# EAGLE design PWM Module (EAGLE 9.2.2)
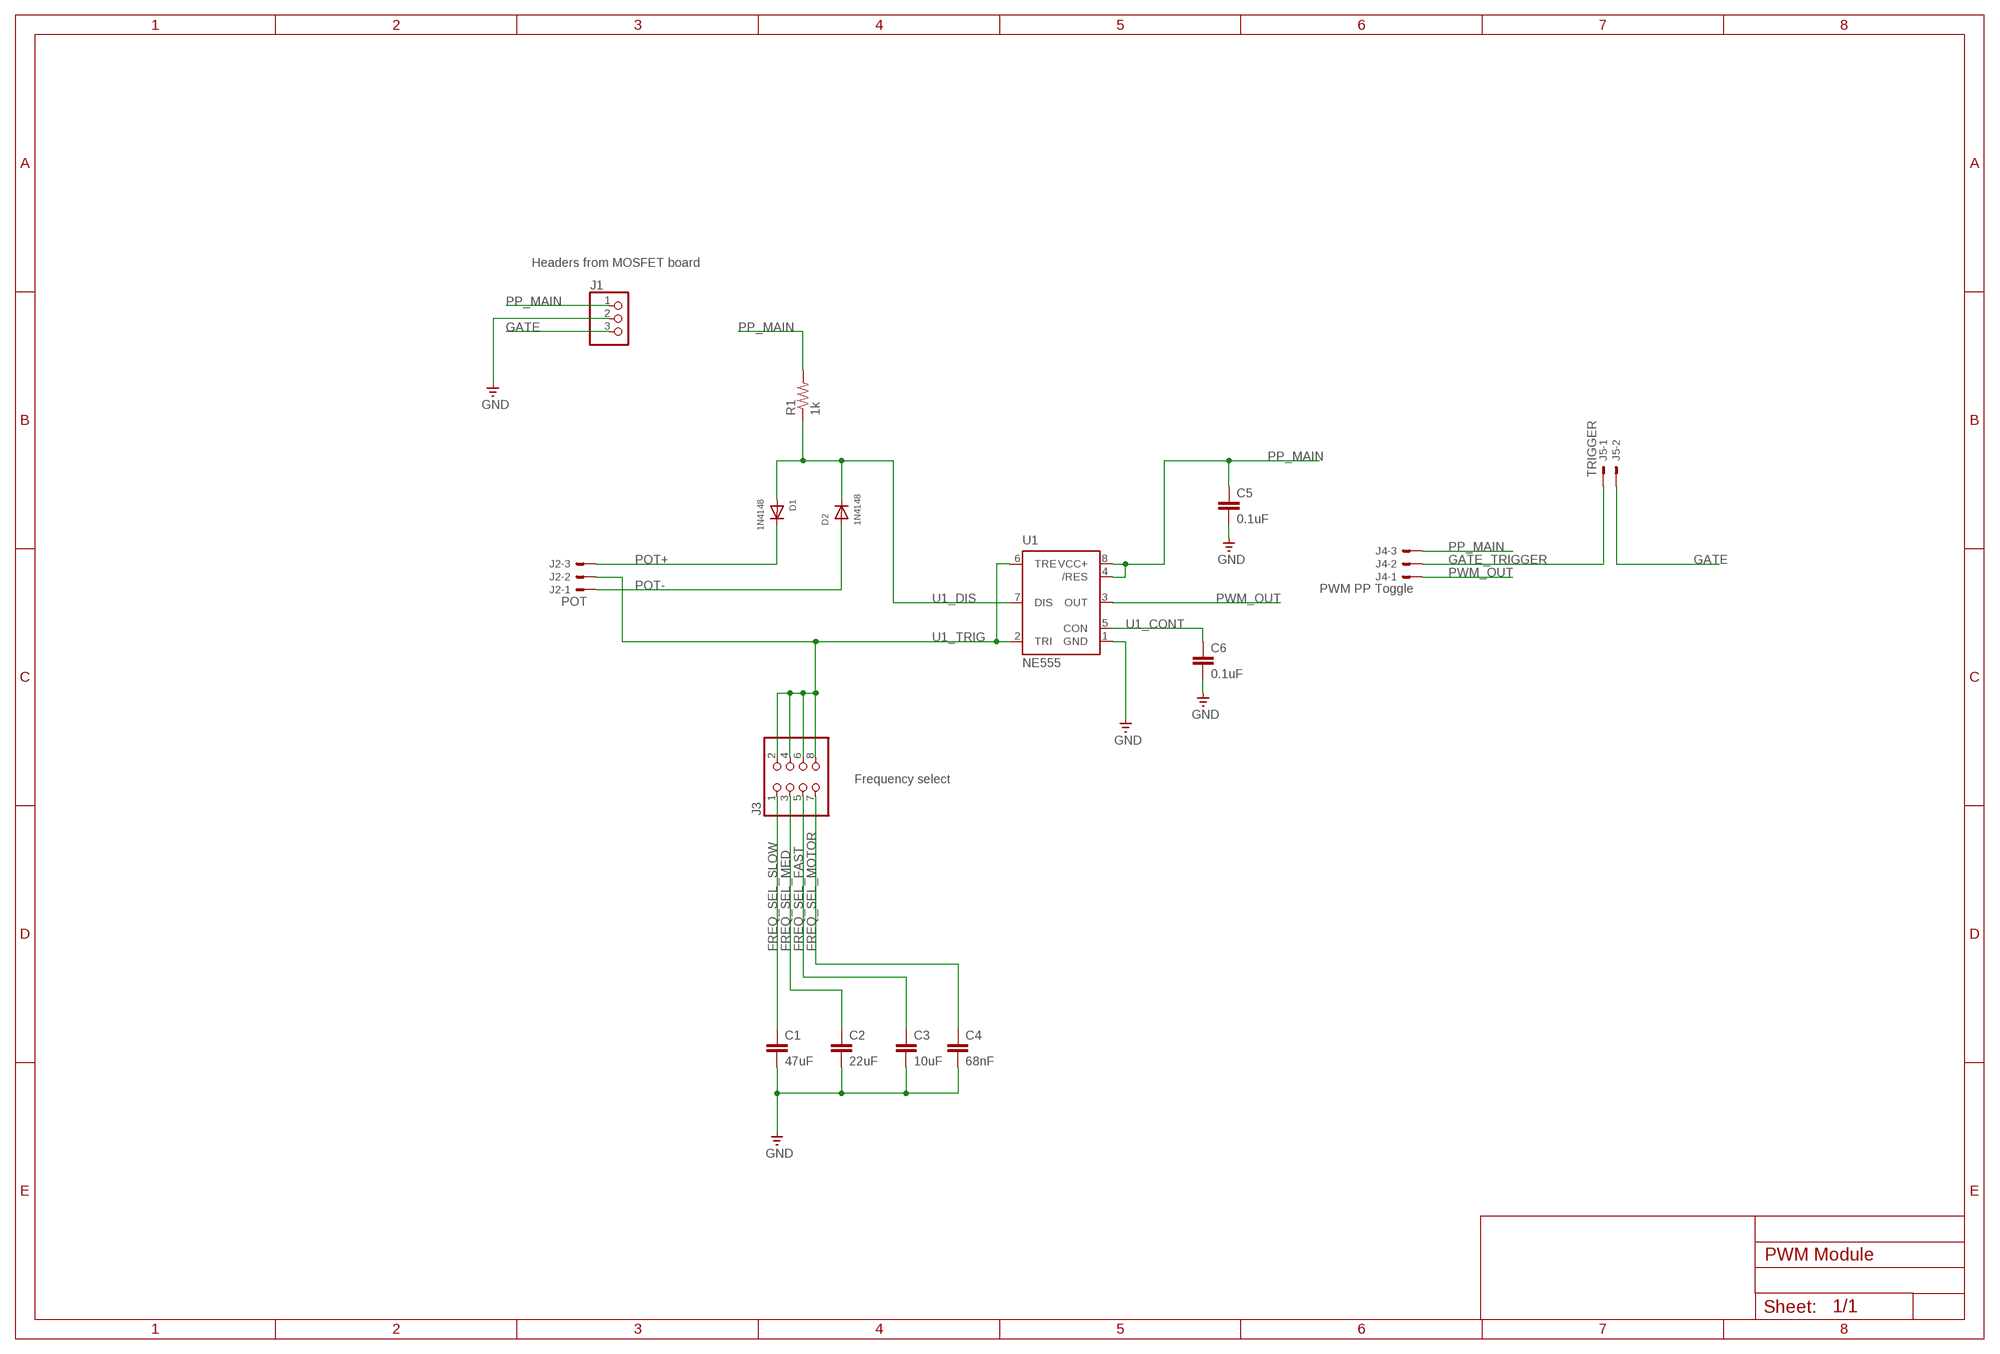
[diagram p0: schematic, sheet 1]

## Parts
C1  47uF  CC1210  [C1210]
C2  22uF  CC1206  [C1206]
C3  10uF  CC1206  [C1206]
C4  68nF  C-EUC0805  [C0805]
C5  0.1uF  C-EUC0805  [C0805]
C6  0.1uF  C-EUC0805  [C0805]
D1  1N4148  DIODEDO-1N4148  [DO-1N4148]
D2  1N4148  DIODEDO-1N4148  [DO-1N4148]
J1  PINHD-1X3  [1X03]
J2  POT  JST-XH-03-PIN-LONG-PAD  [JST-XH-03-PACKAGE-LONG-PAD]
J3  PINHD-2X4  [2X04]
J4  PWM PP Toggle  JST-XH-03-PIN-LONG-PAD  [JST-XH-03-PACKAGE-LONG-PAD]
J5  TRIGGER  JST-XH-02-PIN-LONG-PAD  [JST-XH-02-PACKAGE-LONG-PAD]
R1  1k  R-US_R0805  [R0805]
U1  NE555  [DIL-08]

## Nets
FREQ_SEL_FAST: C3.1 J3.5
FREQ_SEL_MED: C2.1 J3.3
FREQ_SEL_MOTOR: C4.1 J3.7
FREQ_SEL_SLOW: C1.1 J3.1
GATE: J1.3 J5.2
GATE_TRIGGER: J4.2 J5.1
GND: C1.2 C2.2 C3.2 C4.2 C5.2 C6.2 J1.2 U1.1(GND)
POT+: D1.C J2.3
POT-: D2.A J2.1
PP_MAIN: C5.1 J1.1 J4.3 R1.2 U1.4(/RES) U1.8(VCC+)
PWM_OUT: J4.1 U1.3(OUT)
U1_CONT: C6.1 U1.5(CON)
U1_DIS: D1.A D2.C R1.1 U1.7(DIS)
U1_TRIG: J2.2 J3.2 J3.4 J3.6 J3.8 U1.2(TRI) U1.6(TRE)

## Notes on the sheet
- Headers from MOSFET board
- Frequency select

## Library data of the parts
C1-C3 = eagle-ltspice:C: CAPACITOR, European symbol; SPICEMODEL: NONE; SPICEPREFIX: C
C4-C6 = rcl:C-EU: CAPACITOR, European symbol; SPICEPREFIX: C
D1 D2 = adafruit:DIODE: Diode SMADIODE - SMA Surface Mount Package 20V 1A Schottky Diode Digikey: 641-1014-6-ND DO-1N4148 - Through Hole Small Current Diode SOD-123 20V 1 A (.5mV Vf) Schottky Diode - Digikey: MBRX120TPMSCT-ND SOD-323 10V 570mA (.38mV Vf, 3ns) Schottky Diode - Digikey: ZLLS410CT-ND SOD-523 30V 30mA Schottky Diode (RB751S-40TE61) - Digikey: RB751S-40TE61CT-ND SOT23-R/W - SOT23 Package (R = Solder Paste/Reflow Ovens, W = Hand-Soldering) BAT54Film 40V 300mA - Digikey: 497-7162-1-ND
J1 = adafruit:PINHD-1X3: PIN HEADER
J2 J4 = Rembrandt Electronics - JST XH Connectors v1-0:JST-XH-03-PIN: JST XH Connector 2 Pin Wire to board connector. Pitch: 2,54 mm, (0.100") Number of pins: 3 Created by Rembrandt Electronics www.rembrandtelectronics.com
J3 = adafruit:PINHD-2X4: PIN HEADER
J5 = Rembrandt Electronics - JST XH Connectors v1-0:JST-XH-02-PIN: JST XH Connector 2 Pin Wire to board connector. Pitch: 2,54 mm, (0.100") Number of pins: 2 Created by Rembrandt Electronics www.rembrandtelectronics.com
R1 = adafruit:R-US_: RESISTOR, American symbol
U1 = st-microelectronics:NE555: General purpose bipolar Timer; MF: Arrow Electronics; MPN: NE555N; OC_FARNELL: 1467742; OC_NEWARK: 89K1486

## Board
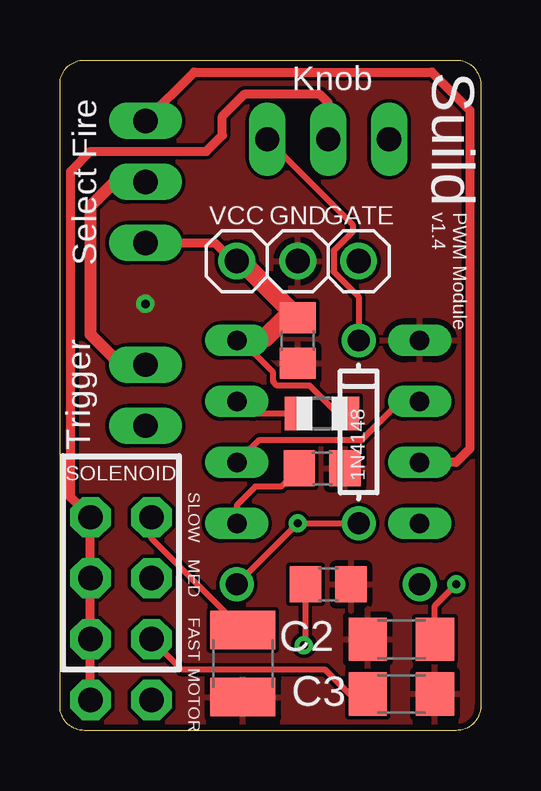
[diagram p1: board, top side]
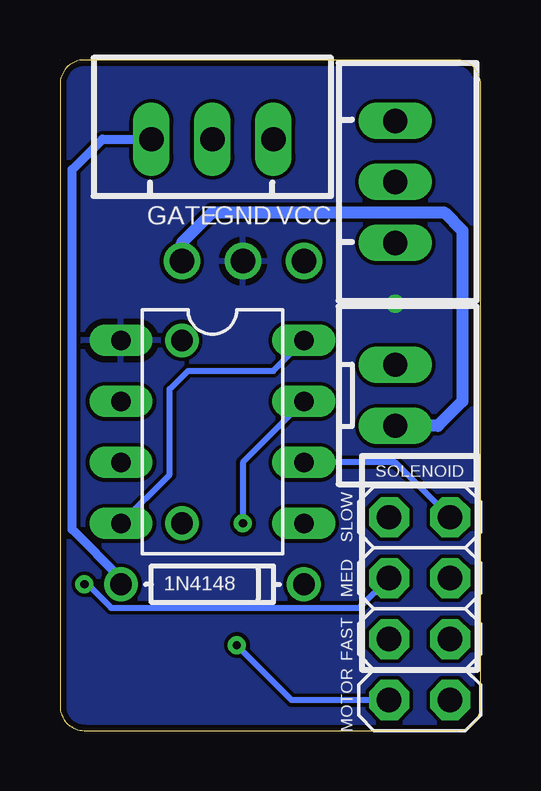
[diagram p2: board, bottom side, seen from below]

Size 17.53 x 27.94 mm. Coordinates in mm from the lower left corner, seen from the top.
Outline: 17.53,27.93 17.53,27.93
Outline: 17.53,27.93 17.53,27.93
Outline: 1.02,0 arc-90 0,1.02 0,26.92 arc-90 1.02,27.94 16.51,27.94 arc-90 17.53,26.92 17.53,1.02 arc-90 16.51,0 1.02,0
Copper layers (1*16): Top 0.035mm / dielectric 1.5mm / Bottom 0.035mm
Design rules "default *": minimum track width 6mil, minimum drill 0.35mm, track to track 6mil, track to pad 6mil, pad to pad 6mil, via to via 6mil, smd to smd 6mil, copper to edge 10mil, drill to drill 10mil, minimum pad ring 10mil, minimum via ring 8mil, stop-mask expansion 4mil, vias tented up to drill 30mil, thermal gap 10mil

### Footprints (pad centres in the part's own frame; a part is rotated, then mirrored left to right if it is on the bottom)
C1210 = smd 1.6 x 2.7: 1 -1.4,0; 2 1.4,0
C1206 = smd 1.6 x 1.8: 1 -1.4,0; 2 1.4,0
C0805 = smd 1.3 x 1.5: 1 -0.95,0; 2 0.95,0
DO-1N4148 = drill 0.9: A -3.81,0; C 3.81,0
1X03 = drill 1.016: 1 -2.54,0; 2 0,0; 3 2.54,0
JST-XH-03-PACKAGE-LONG-PAD = drill 1.016 long: 1 -2.54,0; 2 0,0; 3 2.54,0
2X04 = drill 1.016 pad 1.676 octagon: 1 -3.81,-1.27; 2 -3.81,1.27; 3 -1.27,-1.27; 4 -1.27,1.27; 5 1.27,-1.27; 6 1.27,1.27; 7 3.81,-1.27; 8 3.81,1.27
JST-XH-02-PACKAGE-LONG-PAD = drill 1.016 long: 1 -1.27,0; 2 1.27,0
R0805 = smd 1.1 x 1.4: 1 -1,0; 2 1,0
DIL-08 = drill 0.813 long: 1 -3.81,-3.81; 2 -1.27,-3.81; 3 1.27,-3.81; 4 3.81,-3.81; 5 3.81,3.81; 6 1.27,3.81; 7 -1.27,3.81; 8 -3.81,3.81

### Placement (x,y rotation side)
C1  7.62,2.79 270 top
C2  14.22,3.81 180 top
C3  14.22,1.52 0 top
C4  11.18,6.1 0 top
C5  9.91,16.26 270 top
C6  10.92,10.92 0 top
D1  12.45,12.45 90 top
D2  11.18,6.1 0 bottom
J1  9.91,19.56 0 top
J2  11.18,24.64 0 bottom
J3  2.54,5.08 270 bottom
J4  3.56,22.86 270 bottom
J5  3.56,13.97 270 bottom
R1  10.92,13.21 0 top
U1  11.18,12.45 270 bottom

### Tracks (layer width: path | path; a pad name or v marks a point on that pad's centre or on a via)
FREQ_SEL_FAST
  Top 0.254: C3.1 12.06,1.52 11.05,2.54 5.08,2.54 J3.5
FREQ_SEL_MED  (via drill 0.35)
  Top 0.254: C2.1 15.62,5.21 v16.51,6.1
  Bottom 0.254: v16.51,6.1 16.38,6.1 15.39,5.11 5.05,5.11 J3.3
FREQ_SEL_MOTOR  (via drill 0.35)
  Top 0.254: 9.72,6.1 C4.1 10.23,3.62 v10.16,3.56
  Bottom 0.254: v10.16,3.56 7.87,1.27 J3.7
FREQ_SEL_SLOW
  Top 0.254: C1.1 3.81,8 J3.1
GATE
  Bottom 0.508: J1.3 12.45,20.32 11.18,21.59 1.52,21.59 0.76,20.83 0.76,13.72 1.78,12.7 J5.2
GATE_TRIGGER
  Top 0.381: 2.54,15.24 J5.1
  Top 0.508: J4.2 2.29,22.86 1.27,21.84 1.27,16.51 2.54,15.24
GND  (via drill 0.35)
  other vias: 3.56,17.78
  pour Top: -0.25,28.19 17.78,28.19 17.78,-0.25 -0.25,-0.25
  pour Bottom: -0.51,28.45 18.03,28.45 18.03,-0.51 -0.51,-0.51
POT+
  Top 0.254: J2.3 12.19,21.08 12.19,20.78 11.41,19.99 11.41,19.13 12.45,18.08 D1.C
POT-
  Bottom 0.381: D2.A 14.99,6.35 17.02,8.38 17.02,23.37 15.75,24.64 J2.1
PP_MAIN
  Top 0.254: 10.48,17.21 10.16,17.21 | 14.72,8.64 U1.4 | 7.45,16.34 8.88,14.92 8.88,14.54 9.04,14.38 10.4,14.38 11.57,13.21 R1.2
  Top 0.381: J4.3 6.44,20.32 7.37,19.39
  Top 0.508: C5.1 10.16,17.21 10.23,17.21
  Top 0.762: 7.37,19.39 J1.1 7.55,19.56 C5.1 9.4,17.21 8.54,16.34 7.45,16.34 U1.8
  Bottom 0.254: U1.4 12.95,10.67 12.95,14.22 12.19,14.99 8.64,14.99 U1.8
PWM_OUT
  Top 0.381: J4.1 5.59,27.43 15.49,27.43 17.08,25.85 17.08,11.75 16.51,11.18 U1.3
U1_CONT
  Top 0.254: C6.1 9.21,10.16 8.13,10.16 7.37,9.4 U1.5
U1_DIS  (via drill 0.35)
  Top 0.254: R1.1 7.87,13.21 U1.7 | D1.A v9.91,8.64 D2.C
  Bottom 0.254: U1.7 9.91,11.18 v9.91,8.64
U1_TRIG
  Top 0.254: U1.6 8.31,12.12 12.57,12.12 14.17,13.72 U1.2
  Top 0.381: J2.2 11.18,26.16 10.83,26.5 7.67,26.5 6.77,25.6 6.77,24.8 6.1,24.13 1.27,24.13 0.44,23.3 0.44,9.72 J3.2 J3.4 J3.6 J3.8
  Bottom 0.254: J3.2 3.56,11.18 U1.6

### Text on the board
tNames: Suild | Knob | Select Fire | PWM Module / v1.4 | VCC | GND | GATE | Trigger | SOLENOID | SLOW | MED | FAST | MOTOR
bNames: VCC | GND | GATE | SOLENOID | SLOW | MED | FAST | MOTOR